# EasyEDA schematic Sheet_1.json
TITLE: 指纹门禁原理图; REV: 1.0; Date: 2020-12-18; Sheet: 1/1; Drawn By: cihuayuhang; Company: Your Company
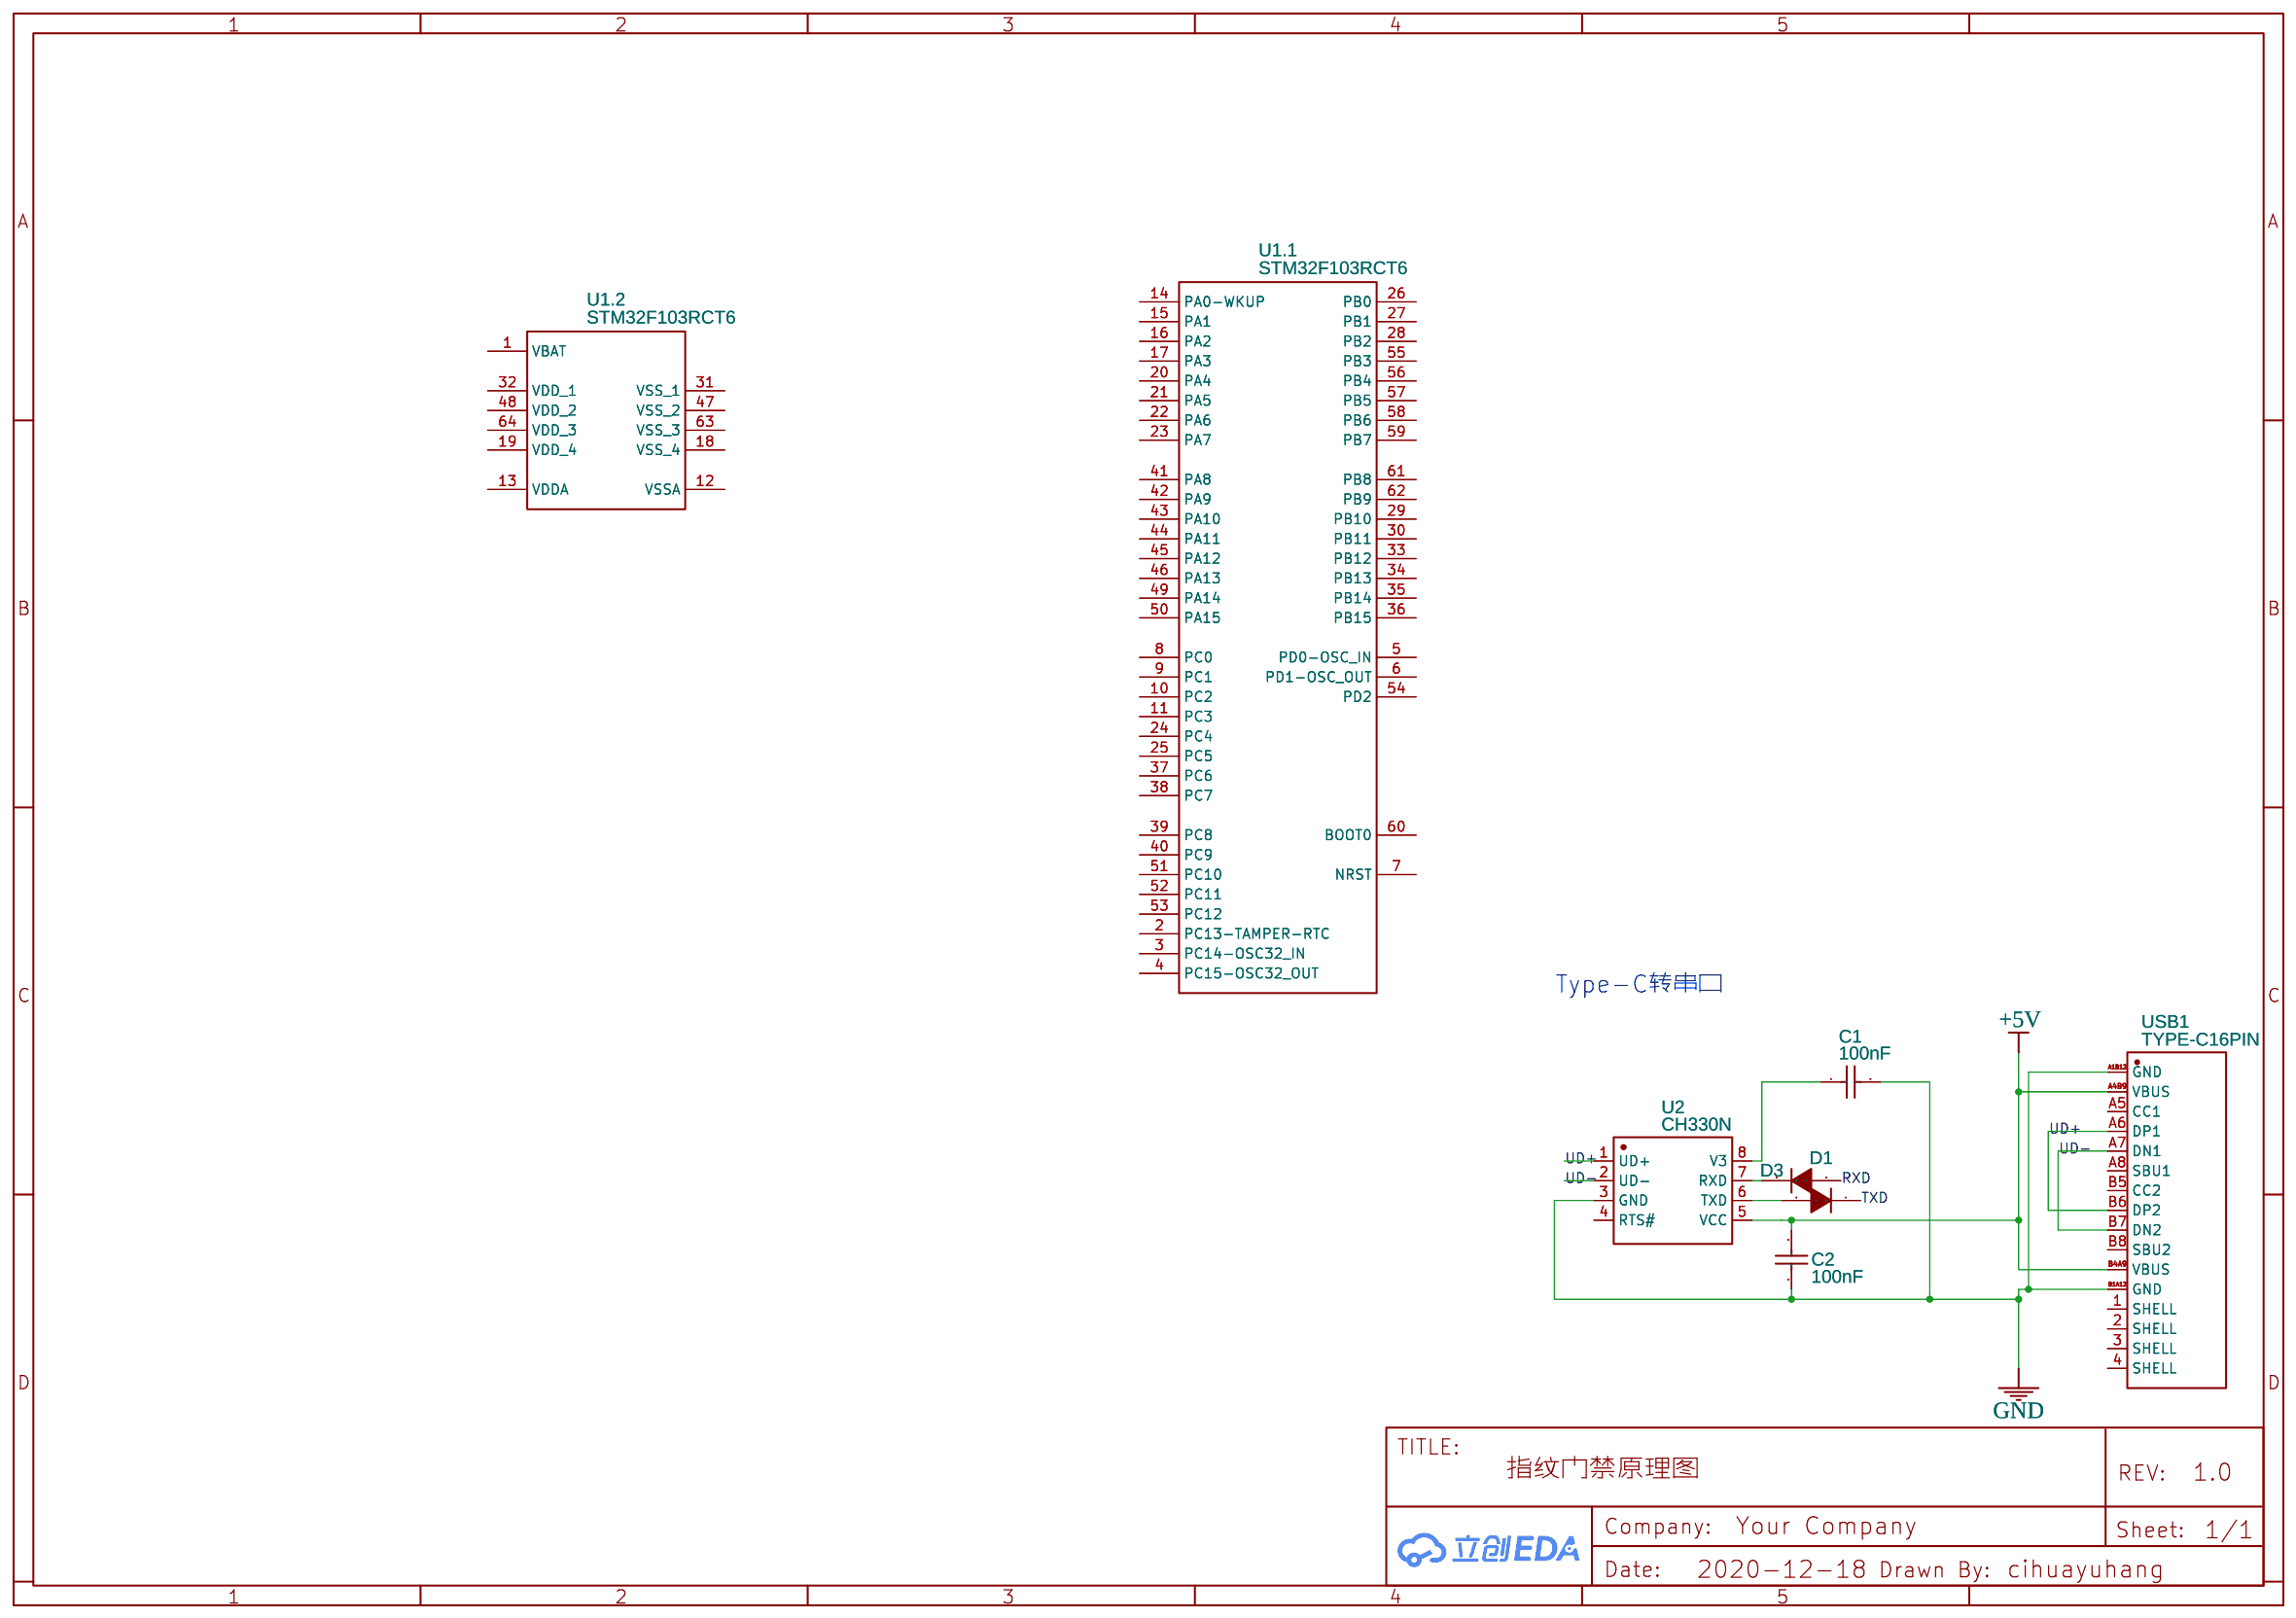
[diagram p0: schematic sheet]

## Parts
C1  100nF  [C0603]
C2  100nF  [C0603]
D1  1N4148W T4  [SOD-123_L2.8-W1.8-LS3.7-RD]
D3  1N4148W T4  [SOD-123_L2.8-W1.8-LS3.7-RD]
U1  STM32F103RCT6  [LQFP-64_L10.0-W10.0-P0.50-LS12.0-BL]  (sections 1,2)
U2  CH330N  [SOP-8_L4.9-W3.9-P1.27-LS6.0-BL]
USB1  TYPE-C16PIN  [USB-C-SMD_TYPE-C16PIN]

## Library data of the parts
C1 C2 = CL10F104ZB8NNNC: Supplier: LCSC; Manufacturer: SAMSUNG; Supplier Part: C1688
D1 D3 = 1N4148W T4: Supplier: LCSC; Manufacturer: CJ; image: //image.lceda.cn/szlcsc/C2099.jpg; Supplier Part: C2099; Contributor: 立创EDA官方封装库; SMT Type: Extend; JLCPCB SMD: Yes
U1 = STM32F103RCT6: Supplier: LCSC; Manufacturer: STMicroelectronics; LCSC Assembly: Yes; image: //image.lceda.cn/szlcsc/C8323.jpg; Supplier Part: C8323; SMT Type: Basic; subpart_no: 1
U2 = CH330N: Supplier: LCSC; Manufacturer: WCH; Supplier Part: C108996
USB1 = TYPE-C16PIN: Supplier: LCSC; Supplier Part: C393939; Manufacturer: SHOU HAN; Contributor: LCSC

## Nets
+5V: C2.2 U2.5(VCC) USB1.A4B9(VBUS) USB1.B4A9(VBUS)
GND: C1.2 C2.1 U2.3(GND) USB1.A1B12(GND) USB1.B1A12(GND)
RXD: D3.2(A)
TXD: D1.1(K)
UD+: U2.1(UD+) USB1.A6(DP1) USB1.B6(DP2)
UD-: U2.2(UD-) USB1.A7(DN1) USB1.B7(DN2)
Net-(C1-1): C1.1 U2.8(V3)
Net-(D1-2): D1.2(A) U2.6(TXD)
Net-(D3-1): D3.1(K) U2.7(RXD)

Not connected (* = marked no-connect by the designer): U1 1(VBAT) 2(PC13-TAMPER-RTC) 3(PC14-OSC32_IN) 4(PC15-OSC32_OUT) 5(PD0-OSC_IN) 6(PD1-OSC_OUT) 7(NRST) 8(PC0) 9(PC1) 10(PC2) 11(PC3) 12(VSSA) 13(VDDA) 14(PA0-WKUP) 15(PA1) 16(PA2) 17(PA3) 18(VSS_4) 19(VDD_4) 20(PA4) 21(PA5) 22(PA6) 23(PA7) 24(PC4) 25(PC5) 26(PB0) 27(PB1) 28(PB2) 29(PB10) 30(PB11) 31(VSS_1) 32(VDD_1) 33(PB12) 34(PB13) 35(PB14) 36(PB15) 37(PC6) 38(PC7) 39(PC8) 40(PC9) 41(PA8) 42(PA9) 43(PA10) 44(PA11) 45(PA12) 46(PA13) 47(VSS_2) 48(VDD_2) 49(PA14) 50(PA15) 51(PC10) 52(PC11) 53(PC12) 54(PD2) 55(PB3) 56(PB4) 57(PB5) 58(PB6) 59(PB7) 60(BOOT0) 61(PB8) 62(PB9) 63(VSS_3) 64(VDD_3); U2 4(RTS#); USB1 1(SHELL) 2(SHELL) 3(SHELL) 4(SHELL) A5(CC1) A8(SBU1) B5(CC2) B8(SBU2)

## Notes on the sheet
- Type-C转串口
